# Altium schematic sheet 11-Power.SchDoc
size B; SheetNumber: 13; SheetTotal: 14; SPICEModelCacheAVYIXNQT: <root> / <DocumentId>AVYIXNQT</DocumentId> / </root>
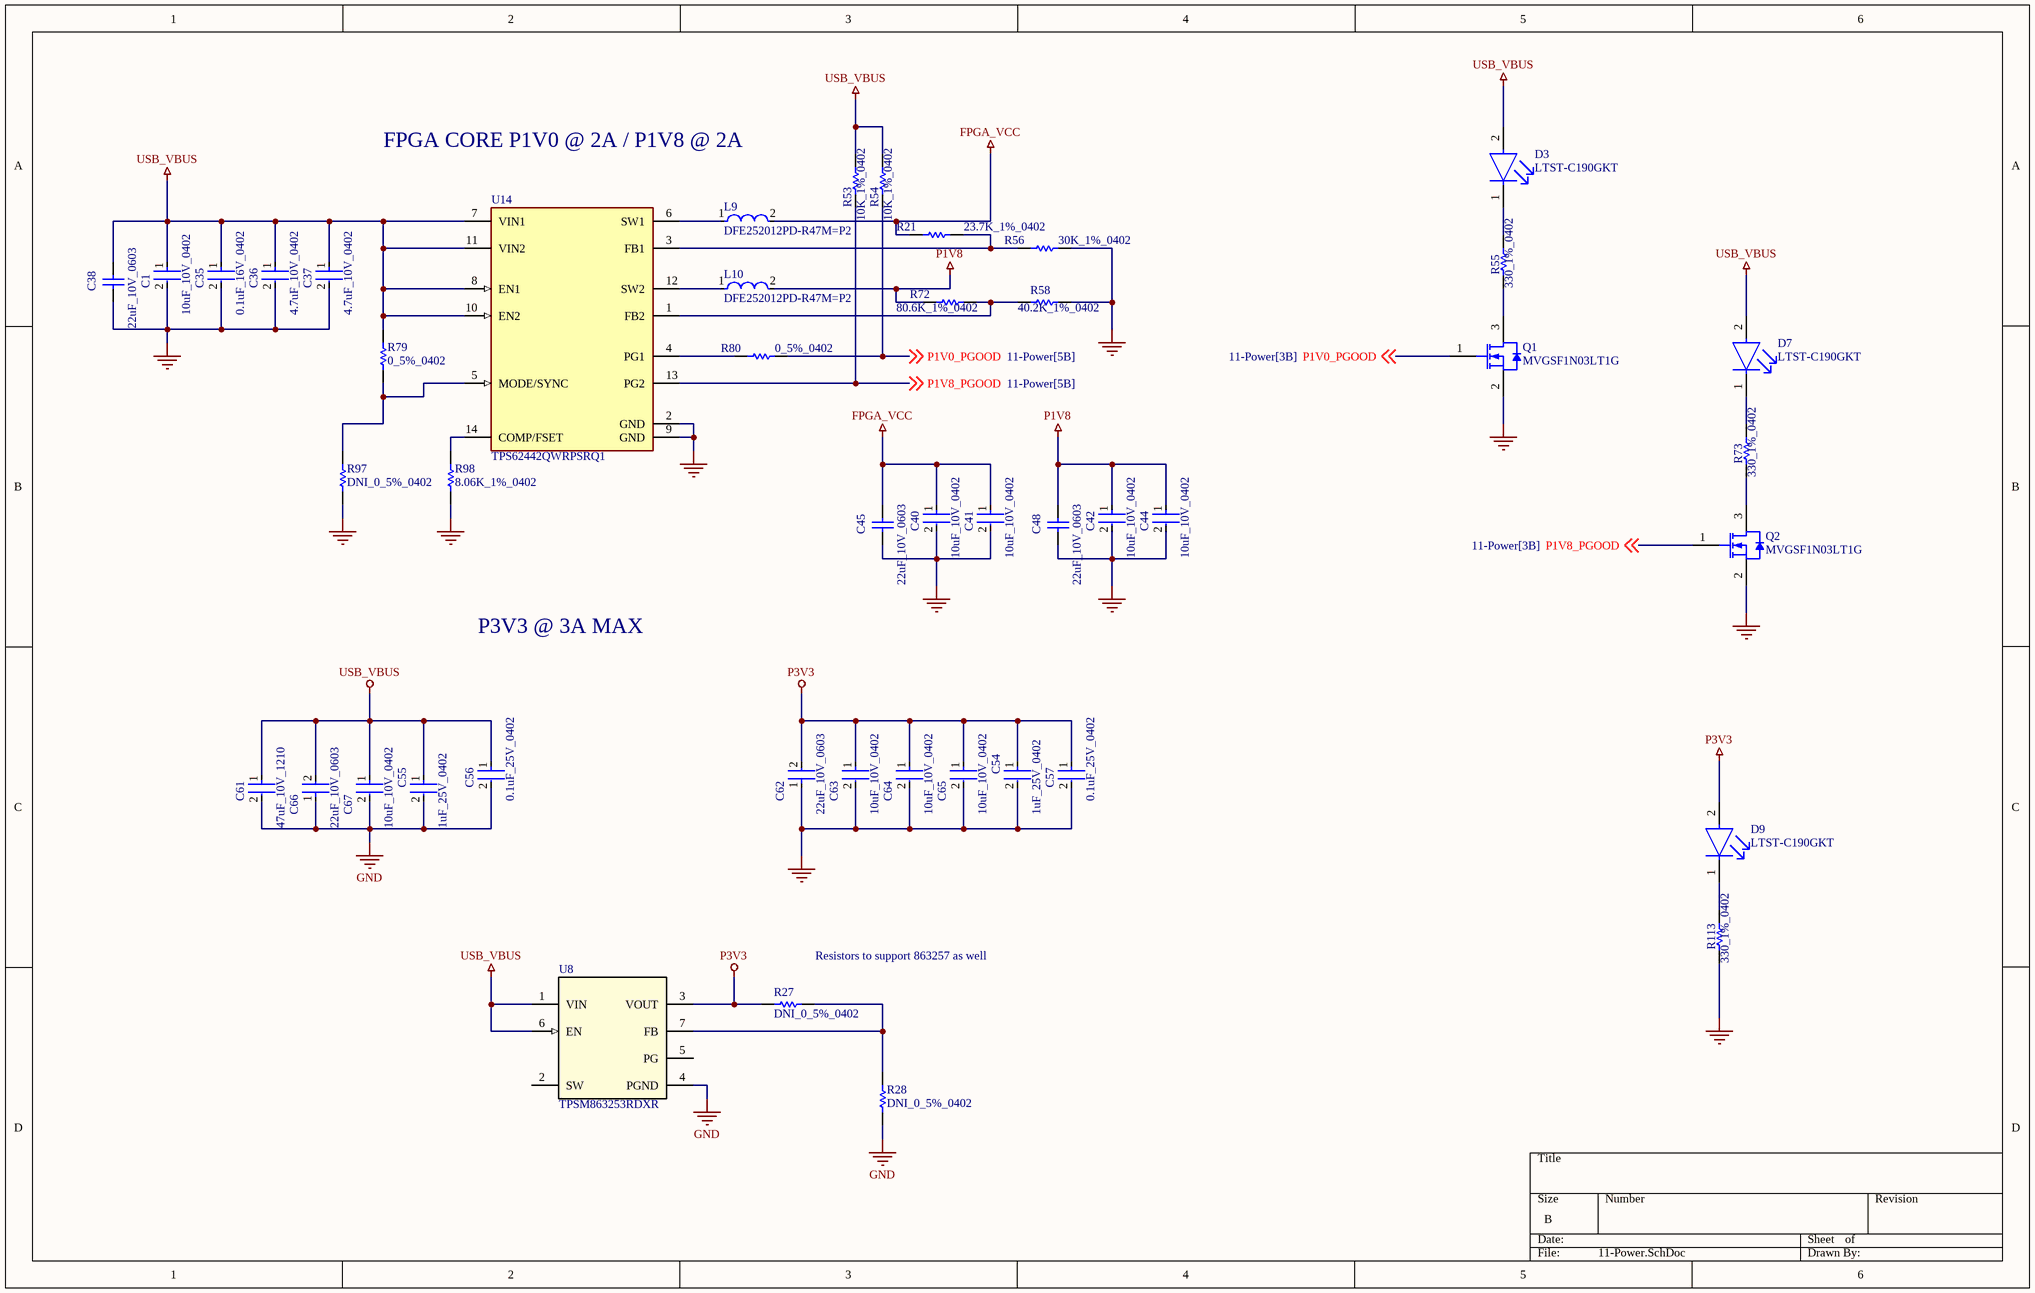
[diagram p0: 11-Power.SchDoc]

## Parts
C1  10uF_10V_0402  [FP-CL05A106MP5NUNC-MFG]
C35  0.1uF_16V_0402  [FP-C0402-BB-MFG]
C36  4.7uF_10V_0402  [FP-C1005-050-0_15-MFG]
C37  4.7uF_10V_0402  [FP-C1005-050-0_15-MFG]
C38  22uF_10V_0603  [CAPC1608X100X20ML10]
C40  10uF_10V_0402  [FP-CL05A106MP5NUNC-MFG]
C41  10uF_10V_0402  [FP-CL05A106MP5NUNC-MFG]
C42  10uF_10V_0402  [FP-CL05A106MP5NUNC-MFG]
C44  10uF_10V_0402  [FP-CL05A106MP5NUNC-MFG]
C45  22uF_10V_0603  [CAPC1608X100X20ML10]
C48  22uF_10V_0603  [CAPC1608X100X20ML10]
C54  1uF_25V_0402  [FP-C1005-050-0_05-IPC_B]
C55  1uF_25V_0402  [FP-C1005-050-0_05-IPC_B]
C56  0.1uF_25V_0402  [FP-0402-L_1_0_0_05-W_0_5-IPC_B]
C57  0.1uF_25V_0402  [FP-0402-L_1_0_0_05-W_0_5-IPC_B]
C61  47uF_10V_1210  [FP-MK325M-MFG]
C62  22uF_10V_0603  [FP-GRM188-0_2-IPC_C]
C63  10uF_10V_0402  [FP-CL05A106MP5NUNC-MFG]
C64  10uF_10V_0402  [FP-CL05A106MP5NUNC-MFG]
C65  10uF_10V_0402  [FP-CL05A106MP5NUNC-MFG]
C66  22uF_10V_0603  [FP-GRM188-0_2-IPC_C]
C67  10uF_10V_0402  [FP-CL05A106MP5NUNC-MFG]
D3  LTST-C190GKT  [FP-LTST-C190GKT-MFG]
D7  LTST-C190GKT  [FP-LTST-C190GKT-MFG]
D9  LTST-C190GKT  [FP-LTST-C190GKT-MFG]
L9  DFE252012PD-R47M=P2  [FP-DFE252012C-IPC_A]
L10  DFE252012PD-R47M=P2  [FP-DFE252012C-IPC_A]
Q1  MVGSF1N03LT1G  [ONSC-SOT-23-3-318-08_V]
Q2  MVGSF1N03LT1G  [ONSC-SOT-23-3-318-08_V]
R21  23.7K_1%_0402  [RESC1005X40X25ML05T05]
R27  DNI_0_5%_0402  [RESC1005X40X25NL05T10]  (no BOM)
R28  DNI_0_5%_0402  [RESC1005X40X25NL05T10]  (no BOM)
R53  10K_1%_0402  [RESC1005X40X25NL10T10]
R54  10K_1%_0402  [RESC1005X40X25NL10T10]
R55  330_1%_0402  [RESC1005X40X25NL10T10]
R56  30K_1%_0402  [RESC1005X40X25ML05T05]
R58  40.2K_1%_0402  [RESC1005X40X25ML05T10]
R72  80.6K_1%_0402  [RESC1005X40X25NL05T10]
R73  330_1%_0402  [RESC1005X40X25NL10T10]
R79  0_5%_0402  [RESC1005X40X25NL05T10]
R80  0_5%_0402  [RESC1005X40X25NL05T10]
R97  DNI_0_5%_0402  [RESC1005X40X25NL05T10]  (no BOM)
R98  8.06K_1%_0402  [RESC1005X40X25ML05T05]
R113  330_1%_0402  [RESC1005X40X25NL10T10]
U8  TPSM863253RDXR  [RDX0007A-MFG]
U14  TPS62442QWRPSRQ1  [FP-RQR0014A-MFG]

## Nets
FPGA_VCC: C40.1 C41.1 C45.2 L9.2 R21.1
GND: C1.2 C35.2 C36.2 C37.2 C38.1 C40.2 C41.2 C42.2 C44.2 C45.1 C48.1 C54.2 C55.2 C56.2 C57.2 C61.2 C62.1 C63.2 C64.2 C65.2 C66.1 C67.2 Q1.2(S) Q2.2(S) R28.2 R56.2 R58.2 R97.1 R98.1 R113.1 U8.4(PGND) U14.2(GND) U14.9(GND)
P1V8: C42.1 C44.1 C48.2 L10.2 R72.1
P3V3: C54.1 C57.1 C62.2 C63.1 C64.1 C65.1 D9.2(A) R27.2 U8.3(VOUT)
USB_VBUS: C1.1 C35.1 C36.1 C37.1 C38.2 C55.1 C56.1 C61.1 C66.2 C67.1 D3.2(A) D7.2(A) R53.2 R54.2 R79.2 U8.1(VIN) U8.6(EN) U14.7(VIN1) U14.8(EN1) U14.10(EN2) U14.11(VIN2)
P1V0_PGOOD: Q1.1(G) R54.1 R80.2 ; off-sheet P1V0_PGOOD
P1V8_PGOOD: Q2.1(G) R53.1 U14.13(PG2) ; off-sheet P1V8_PGOOD
NetD3_1: D3.1(C) R55.2
NetD7_1: D7.1(C) R73.2
NetD9_1: D9.1(C) R113.2
NetL9_1: L9.1 U14.6(SW1)
NetL10_1: L10.1 U14.12(SW2)
NetQ1_3: Q1.3(D) R55.1
NetQ2_3: Q2.3(D) R73.1
NetR21_2: R21.2 R56.1 U14.3(FB1)
NetR27_1: R27.1 R28.1 U8.7(FB)
NetR58_1: R58.1 R72.2 U14.1(FB2)
NetR79_1: R79.1 R97.2 U14.5(MODE/SYNC)
NetR80_1: R80.1 U14.4(PG1)
NetR98_2: R98.2 U14.14(COMP/FSET)

Not connected (* = marked no-connect by the designer): U8 2(SW) 5(PG)

## Notes on the sheet
- FPGA CORE P1V0 @ 2A / P1V8 @ 2A
- P3V3 @ 3A MAX
- (near R27) Resistors to support 863257 as well

## Library data of the parts
C1 C40-C42 C44 C63-C65 C67 = CMP-13271-000002-1: CAP CER 10UF 10V X5R 0402; Manufacturer Part Number: CL05A106MP5NUNC; Manufacturer: Samsung; Temperature Coefficient: 15%; Tolerance: 20%; Material: Ceramic; Octopart: https://octopart.com/cl05a106mp5nunc-samsung-22457395; Voltage Rating: 10V; RoHS: TRUE; Value: 10uF; Height: 0.7mm; Digikey Description: CAP CER 10UF 10V X5R 0402; Automotive: No; Package: CL05A106MP5NUNC; Device Class L1: Passive Components; Capacitance: 10uF; Temperature Range High: +85°C; ComponentLink2Description: Datasheet; Device Class L2: Capacitors; Temperature Characteristic: X5R; Temperature: -55°C to +85°C; ComponentLink2URL: http://www.samsungsem.com/kr/support/product-search/mlcc/__icsFiles/afieldfile/2019/05/10/19-CL05A106MP5NUNC.pdf; Device Class L3: Ceramic Capacitors; Category: Cap; Temperature Range Low: -55°C; Ipc Land Pattern Name: CAPC10050X50; Lead Free: Yes
C35 = CMP-1034-02068-3: CAP CER 0.1UF 16V 5% X7R 0402; Manufacturer: Kemet; Manufacturer Part Number: C0402C104J4RACTU; Value: 0.10 μF; Temperature Coefficient: 15%; Tolerance: 0.05; Material: Ceramic; ComponentLink2URL: https://content.kemet.com/datasheets/KEM_C1002_X7R_SMD.pdf; Automotive: No; Device Class L2: Capacitors; Temperature: -55°C to +125°C; RoHS: TRUE; Voltage Rating: 16 V; ComponentLink2Description: Datasheet; Device Class L3: Ceramic Capacitors; Temperature Range Low: -55°C; Ipc Land Pattern Name: CAPC10050X50; Device Class L1: Passive Components; Temperature Range High: +125°C; Package: C0402-BB; Capacitance: 0.10 μF; Category: Cap; Mouser Description: CAP CER 0.1UF 16V X7R 0402; Height: 0.55mm; Digikey Description: CAP CER 0.1UF 16V 5% X7R 0402; Octopart: https://octopart.com/c0402c104j4ractu-kemet-12573893; Temperature Characteristic: X7R; Lead Free: Yes
C36 C37 = CMP-2000-05997-2: CAP CER 4.7UF 10V X5R 0402; Dielectric Material: Ceramic; Tolerance: 10%; Series: C; Package Quantity: 10000; Max Operating Temperature: 85°C; Case Code (Imperial): 0402; Lead Free: Lead Free; Voltage Rating (DC): 10V; Packaging: Cut Tape; Voltage Rating: 10V; Min Operating Temperature: -55°C; Dielectric: X5R; Thickness: 0.022inch; Width: 0.02inch; Case/Package: 0402; Case Code (Metric): 1005; Capacitance: 4.7uF; Length: 0.039inch; RoHS Compliant: Yes; REACH SVHC: No SVHC; Mount: Surface Mount
C38 C45 C48 = CMP-2000-05441-1: Chip Capacitor, 22 uF, +/- 20%, 10 V, -55 to 85 degC, 0603 (1608 Metric), RoHS, Tape and Reel; Manufacturer: TDK; PCN Part Number: MLCCPartNumberChange30/Nov/2012; Voltage - Rated: 10V; Product Training Modules: CSeriesGeneralApplicationsSEAT,CCV,andTVCLDesignToolsGuidetoReplacinganElectrolyticCapacitorwithanMLCC; Other Names: 445-9077-1; Design Resources: 20WNon-IsolatedBuckLEDDriverUsingPLLNK460KG; Online Catalog: CSeries,GeneralPurpose; Capacitance: 22µF; Temperature Coefficient: X5R; Kits: 445-9014-KIT-ND-KITMLCC100PF-22UF060310-50V; Packaging: CutTape(CT); Standard Package: 1; Package / Case: 0603(1608Metric); Lead Style: -; Features: -; Ratings: -; Operating Temperature: -55degC~85degC; Applications: GeneralPurpose; Package Reference: 603; Datasheet URL: http://download.siliconexpert.com/pdfs/2015/4/21/15/54/45/779/tdk_/manual/37024850441143360mlcc_commercial_general_en.pdf; Datasheet Version: Mar-15; Mounting Type: SurfaceMount,MLCC; Lead Spacing: -; Size / Dimension: 0.063"Lx0.031"W(1.60mmx0.80mm); Height - Seated (Max): -; Package Description: 2-Pin Surface Mount Device, Body 1.6 x 0.8 mm; Manufacturer URL: http://www.tdk.com/; RoHS Information: RoHSCertificate-MLCC; Tolerance: ±20%; Series: C; Thickness (Max): 0.035"(0.90mm); Family: CeramicCapacitors; Category: Capacitors
C54 C55 = CMP-2000-06001-2: Multilayer Ceramic Capacitors 1μF ±10% 25V X5R SMD 0402; Capacitance: 1uF; Package Quantity: 1; Radiation Hardening: No; Dielectric: X5R; REACH SVHC: No SVHC; RoHS Compliant: Yes; Case Code (Imperial): 0402; Voltage Rating: 25V; Termination: SMD/SMT; Max Operating Temperature: 85°C; Series: C; Packaging: Tape and Reel; Tolerance: 10%; Voltage Rating (DC): 25V; Weight: 2.3E-05oz; Height: 0.5mm; Resistor Type: Ceramic; Thickness: 0.022inch; Min Operating Temperature: -55°C; Length: 1mm; Lead Free: Lead Free; Depth: 0.5mm; Dielectric Material: Ceramic; Width: 0.02inch; Case/Package: 0402; Case Code (Metric): 1005; Mount: Surface Mount
C56 C57 = CMP-14477-000014-3: None; Voltage Rating (DC): 25V; Tolerance: 10%; Capacitance: 100nF; Dielectric: X5R; Max Operating Temperature: 85°C; Resistor Type: Ceramic; Packaging: Tape and Reel; Lead Free: Lead Free; Case Code (Imperial): 0402; Thickness: 0.022inch; Series: M; Construction: Flat; Number of Pins: 2; Width: 0.5mm; Halogen Free: Halogen Free; Case/Package: 0402; Voltage: 25V; Height: 0.5mm; Mount: Surface Mount; Min Operating Temperature: -55°C; Case Code (Metric): 1005; Length: 1mm; Depth: 0.5mm; Voltage Rating: 25V; Package Quantity: 1; Weight: 2.3E-05oz; RoHS Compliant: Yes; Termination: SMD/SMT; REACH SVHC: No SVHC
C61 = CMP-2000-06559-2: CAP CER 47UF 10V X7R 1210; Tolerance: 20%; Packaging: Tape and Reel; Length: 3.2mm; Height: 2.5mm; Case Code (Metric): 3225; Min Operating Temperature: -55°C; Package Quantity: 500; Halogen Free: Halogen Free; Voltage Rating: 10V; Resistor Type: Ceramic; Capacitance: 47uF; Termination: SMD/SMT; Number of Pins: 2; Lead Free: Lead Free; Voltage Rating (DC): 10V; Width: 2.5mm; Case/Package: 1210; Dielectric: X7R; Mount: Surface Mount; Max Operating Temperature: 125°C; Construction: Flat; Case Code (Imperial): 1210; RoHS Compliant: Yes; Depth: 2.5mm; Thickness: 0.106inch; Voltage: 10V; Series: M; Radiation Hardening: No
C62 C66 = CMP-2000-06337-3: Chip Multilayer Ceramic Capacitors for General Purpose, 0603, 22uF, X5R, 15%, 20%, 10V; Tolerance: 20%; Weight: 0.000222oz; Material: Ceramic; Depth: 0.8mm; Length: 1.6mm; Termination: SMD/SMT; Capacitance: 22uF; Packaging: Tape and Reel; Width: 0.8mm; Voltage Rating: 10V; Case Code (Imperial): 0603; Mount: Surface Mount; Voltage Rating (DC): 10V; Case/Package: 0603; Thickness: 0.039inch; REACH SVHC: No SVHC; Dielectric: X5R; Height: 0.8mm; Package Quantity: 4000; Case Code (Metric): 1608; Min Operating Temperature: -55°C; Lead Free: Lead Free; Max Operating Temperature: 85°C
D3 D7 D9 = CMP-22017-000005-2: LED GREEN CLEAR CHIP SMD; Dominant Wavelength: 569nm; Reverse Voltage: 5V; Lens Color: Colorless; Viewing Angle: 130°; Voltage: 2V; Forward Current: 30mA; Power Dissipation: 100mW; Luminous Intensity: 6mcd; Number of LEDs: 1; Forward Voltage: 2.1V; Wavelength: 565nm; Test Current: 10mA; Min Operating Temperature: -55°C; Lens Style: Clear; Mount: Surface Mount; Width: 0.8mm; Packaging: Tape and Reel; Lens Transparency: Clear; Case Code (Metric): 1608; Depth: 0.8mm; Case Code (Imperial): 0603; Case/Package: 0603; Number of Pins: 2; Max Operating Temperature: 85°C; Lead Free: Lead Free; Number of Elements: 1; Length: 1.6mm; Height: 0.8mm; Package Quantity: 1; Power Rating: 100mW; Radiation Hardening: No; Illumination Color: Green; Color: Green
L9 L10 = CMP-06042-015149-1: Shielded Wirewound Inductor 0.47uH 20% 4000mA 0.027Ω 1008 (2520)
Q1 Q2 = CMP-1058-00779-1: Power MOSFET, 30 V, 2.1 A, Single N-Channel, 3-Pin SOT-23, Pb-Free, Tape and Reel; Manufacturer: On Semiconductor; V(BR)DSS Min (V): 30; VGS(th) Max (V): 2.4; Ciss Typ (pF): 140; VGS Max (V): 20; Channel Polarity: N Channel; ID Max (A): 2.1; Coss Typ (pF): 100; Crss Typ (pF): 40; ComponentLink3URL: http://www.onsemi.cn/pub_link/Collateral/318-08.PDF; Configuration: Single; PackageDescription: 3-Pin Small Outline Transistor, Body 2.92 x 1.3 mm, Pitch 0.95 mm; Packing: Tape and Reel; PartNumber: MVGSF1N03LT1G; ComponentLink2URL: http://www.onsemi.cn/pub_link/Collateral/MGSF1N03LT1-D.PDF; PackageVersion: Rev. AP, 11/2009; ComponentLink3Description: Package Specification; Package Type: SOT-23-3; ComponentLink1Description: Manufacturer URL; DatasheetVersion: Rev. 10; PackageReference: SOT-23-3-318-08; ComponentLink2Description: Datasheet; ComponentLink1URL: http://www.onsemi.com/; RoHS: Pb-Free; Mounting Technology: Surface Mount
R21 = CMP-1011-00663-2: Part Number: CRCW040223K7FKED; Manufacturer: Vishay Dale
R27 R28 R79 R80 R97 = CMP-2002-06457-1: Manufacturer: Panasonic; Part Number: ERJ-U020R00X
R53 R54 = CMP-2002-04694-1: Manufacturer: Bourns; Part Number: CR0402-FX-1002GLF
R55 R73 R113 = CMP-2002-05853-1: Manufacturer: Panasonic; Part Number: ERA-2AED331X
R56 = CMP-2002-00511-1: Part Number: ERJ-2GEJ303X; Manufacturer: Panasonic
R58 = CMP-2002-07676-1: Part Number: RC0402FR-0740K2L; Manufacturer: Yageo / Phycomp
R72 = CMP-2002-07812-1: Part Number: RC0402FR-0780K6L; Manufacturer: Yageo / Phycomp
R98 = CMP-2002-00253-3: Chip Resistor, 8.06 KOhm, +/- 1%, 63 mW, -55 to 155 degC, 0402 (1005 Metric), RoHS, Tape and Reel; PartNumber: CRCW04028K06FKED; Manufacturer: Basic Passives; Case\/Package: 0402; Power Rating: 63 mW; Voltage Rating: 50 V; PackageReference: 0402; Radiation Hardening: No; Package Quantity: 10000; Height: 0.35 mm; Packaging: Tape and Reel; Mount: Surface Mount; Length: 1 mm; Weight: 2.3E-05oz; Case Code (Metric): 1005; DatasheetVersion: 06/2012; Pins: 2; Min Operating Temperature: -55 degC; Case Code (Imperial): 0402; REACH SVHC: Unknown; Tolerance: 1%; Mounting Technology: Surface Mount; ComponentLink1URL: http://www.vishay.com/; ComponentLink2URL: http://www.vishay.com/docs/20035/dcrcwe3.pdf; ComponentLink2Description: Datasheet; Resistance: 8.06 KOhm; Max Operating Temperature: 155 degC; ComponentLink1Description: Manufacturer URL; Width: 0.5 mm; RoHSCompliant: true; PackageDescription: 2-Pin Surface Mount Device, Body 1 x 0.5 mm
U8 = TPSM863253RDXR: No Description Available; Mfr_Name: Texas Instruments; TYPE: TYPE; RefDes: RefDes
U14 = CMP-04918-000654-1: Adjustable-Frequency Dual Step-Down Converter, 2.7-6V VIN, 0.6-5.5V 2A VOUT, VQFN-HR14